# Altium project S7CAS-PLEIADES-CARTE-FILLE_P02.PrjPcb (part 2 of 2)
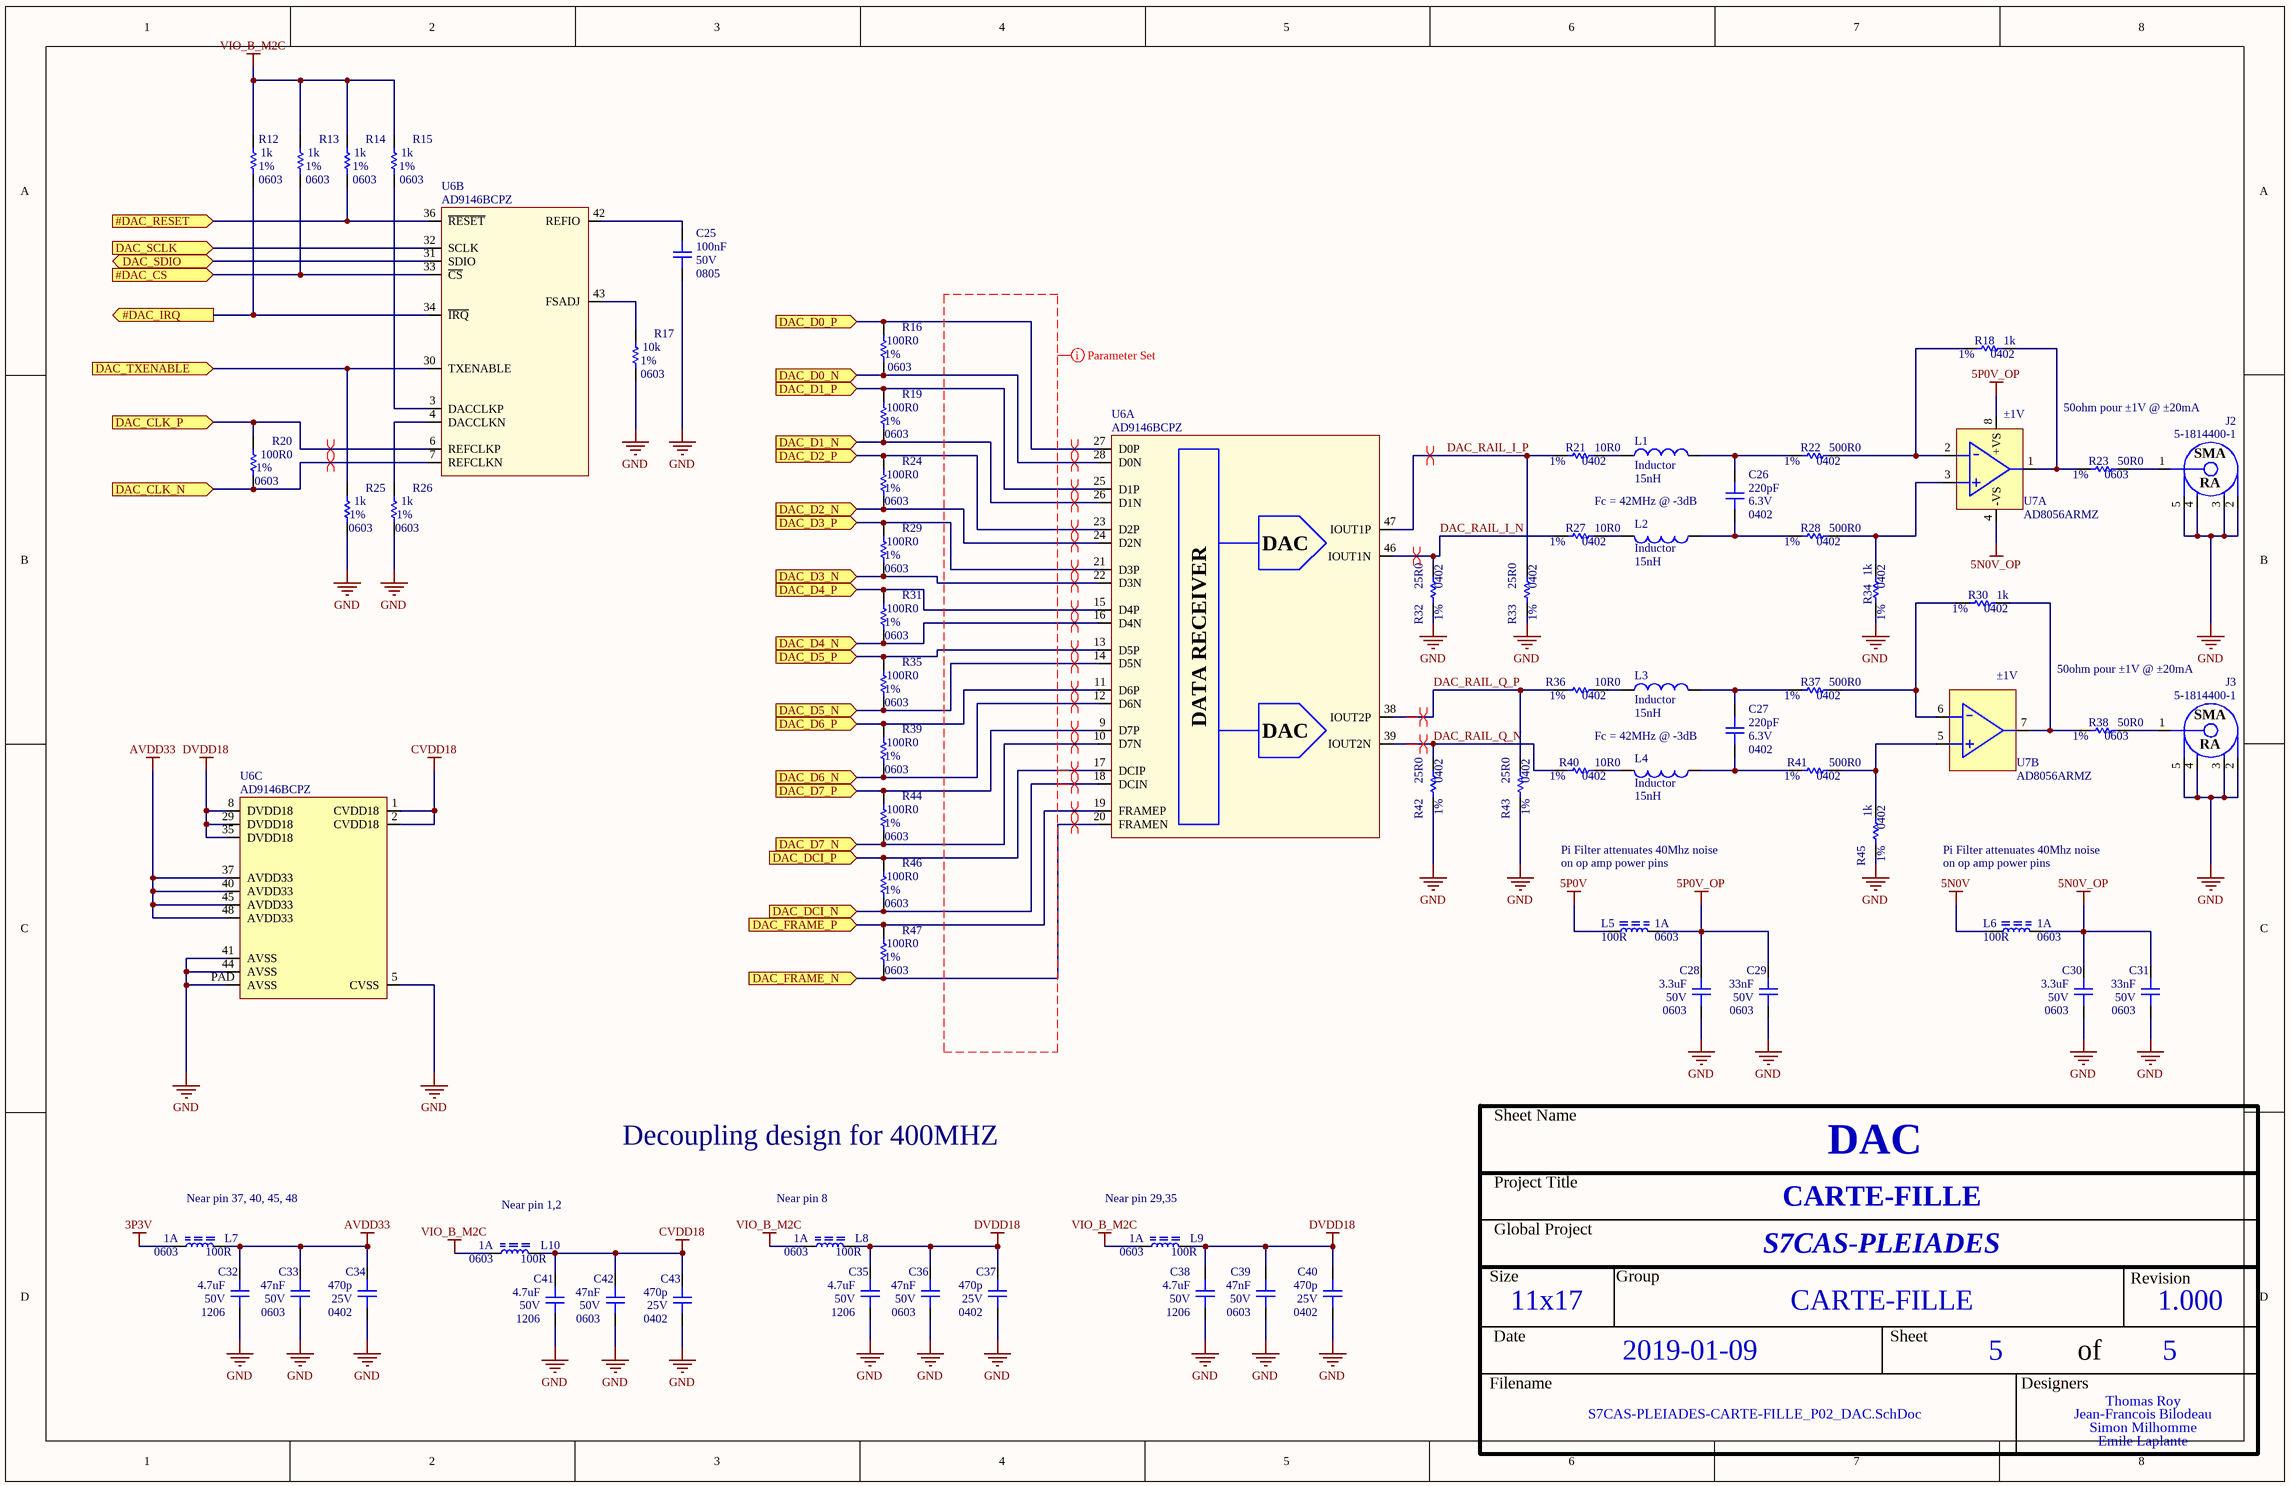
[diagram p5: S7CAS-PLEIADES-CARTE-FILLE_P02_DAC.SchDoc]

## Nets that join several sheets
3P3V: S7CAS-PLEIADES-CARTE-FILLE_P02_ALIMENTATION (C20.2 C21.2 U?.3), S7CAS-PLEIADES-CARTE-FILLE_P02_CONNECTEUR_FMC (7 pins), S7CAS-PLEIADES-CARTE-FILLE_P02_ADC (L16.1 L17.1 L50.1 L51.1), S7CAS-PLEIADES-CARTE-FILLE_P02_DAC (L7.1)
5N0V: S7CAS-PLEIADES-CARTE-FILLE_P02_ALIMENTATION (C18.2 R7.2 U4.3), S7CAS-PLEIADES-CARTE-FILLE_P02_DAC (L6.2)
5P0V: S7CAS-PLEIADES-CARTE-FILLE_P02_ALIMENTATION (C8.2 R4.2 U2.2 U2.4), S7CAS-PLEIADES-CARTE-FILLE_P02_DAC (L5.2)
12P0V: S7CAS-PLEIADES-CARTE-FILLE_P02_ALIMENTATION (7 pins), S7CAS-PLEIADES-CARTE-FILLE_P02_CONNECTEUR_FMC (J1.E35 J1.E37)
AVDD33: S7CAS-PLEIADES-CARTE-FILLE_P02_ADC (25 pins), S7CAS-PLEIADES-CARTE-FILLE_P02_DAC (8 pins)
GND: S7CAS-PLEIADES-CARTE-FILLE_P02_ALIMENTATION (26 pins), S7CAS-PLEIADES-CARTE-FILLE_P02_CONNECTEUR_FMC (162 pins), S7CAS-PLEIADES-CARTE-FILLE_P02_ADC (45 pins), S7CAS-PLEIADES-CARTE-FILLE_P02_DAC (38 pins)
VIO_B_M2C: S7CAS-PLEIADES-CARTE-FILLE_P02_ALIMENTATION (5 pins), S7CAS-PLEIADES-CARTE-FILLE_P02_CONNECTEUR_FMC (J1.J39 J1.K40), S7CAS-PLEIADES-CARTE-FILLE_P02_ADC (9 pins), S7CAS-PLEIADES-CARTE-FILLE_P02_DAC (7 pins)
#ADC_SEN: S7CAS-PLEIADES-CARTE-FILLE_P02_CONNECTEUR_FMC (J1.D25), S7CAS-PLEIADES-CARTE-FILLE_P02_ADC (U8.15)
#DAC_CS: S7CAS-PLEIADES-CARTE-FILLE_P02_CONNECTEUR_FMC (J1.J25), S7CAS-PLEIADES-CARTE-FILLE_P02_DAC (R13.1 U6.33)
#DAC_IRQ: S7CAS-PLEIADES-CARTE-FILLE_P02_CONNECTEUR_FMC (J1.D22), S7CAS-PLEIADES-CARTE-FILLE_P02_DAC (R12.1 U6.34)
#DAC_RESET: S7CAS-PLEIADES-CARTE-FILLE_P02_CONNECTEUR_FMC (J1.C21), S7CAS-PLEIADES-CARTE-FILLE_P02_DAC (R14.1 U6.36)
ADC_CLK_N: S7CAS-PLEIADES-CARTE-FILLE_P02_CONNECTEUR_FMC (J1.K5), S7CAS-PLEIADES-CARTE-FILLE_P02_ADC (C45.2 R48.1)
ADC_CLK_P: S7CAS-PLEIADES-CARTE-FILLE_P02_CONNECTEUR_FMC (J1.K4), S7CAS-PLEIADES-CARTE-FILLE_P02_ADC (C44.2 R48.2)
ADC_CLKOUT_N: S7CAS-PLEIADES-CARTE-FILLE_P02_CONNECTEUR_FMC (J1.H5), S7CAS-PLEIADES-CARTE-FILLE_P02_ADC (U8.56)
ADC_CLKOUT_P: S7CAS-PLEIADES-CARTE-FILLE_P02_CONNECTEUR_FMC (J1.H4), S7CAS-PLEIADES-CARTE-FILLE_P02_ADC (U8.57)
ADC_CTRL1: S7CAS-PLEIADES-CARTE-FILLE_P02_CONNECTEUR_FMC (J1.C24), S7CAS-PLEIADES-CARTE-FILLE_P02_ADC (U8.35)
ADC_CTRL2: S7CAS-PLEIADES-CARTE-FILLE_P02_CONNECTEUR_FMC (J1.C25), S7CAS-PLEIADES-CARTE-FILLE_P02_ADC (U8.36)
ADC_CTRL3: S7CAS-PLEIADES-CARTE-FILLE_P02_CONNECTEUR_FMC (J1.K28), S7CAS-PLEIADES-CARTE-FILLE_P02_ADC (U8.37)
ADC_DA0_N: S7CAS-PLEIADES-CARTE-FILLE_P02_CONNECTEUR_FMC (J1.H26), S7CAS-PLEIADES-CARTE-FILLE_P02_ADC (U8.40)
ADC_DA0_P: S7CAS-PLEIADES-CARTE-FILLE_P02_CONNECTEUR_FMC (J1.H25), S7CAS-PLEIADES-CARTE-FILLE_P02_ADC (U8.41)
ADC_DA2_N: S7CAS-PLEIADES-CARTE-FILLE_P02_CONNECTEUR_FMC (J1.G25), S7CAS-PLEIADES-CARTE-FILLE_P02_ADC (U8.42)
ADC_DA2_P: S7CAS-PLEIADES-CARTE-FILLE_P02_CONNECTEUR_FMC (J1.G24), S7CAS-PLEIADES-CARTE-FILLE_P02_ADC (U8.43)
ADC_DA4_N: S7CAS-PLEIADES-CARTE-FILLE_P02_CONNECTEUR_FMC (J1.H23), S7CAS-PLEIADES-CARTE-FILLE_P02_ADC (U8.44)
ADC_DA4_P: S7CAS-PLEIADES-CARTE-FILLE_P02_CONNECTEUR_FMC (J1.H22), S7CAS-PLEIADES-CARTE-FILLE_P02_ADC (U8.45)
ADC_DA6_N: S7CAS-PLEIADES-CARTE-FILLE_P02_CONNECTEUR_FMC (J1.G22), S7CAS-PLEIADES-CARTE-FILLE_P02_ADC (U8.46)
ADC_DA6_P: S7CAS-PLEIADES-CARTE-FILLE_P02_CONNECTEUR_FMC (J1.G21), S7CAS-PLEIADES-CARTE-FILLE_P02_ADC (U8.47)
ADC_DA8_N: S7CAS-PLEIADES-CARTE-FILLE_P02_CONNECTEUR_FMC (J1.E23), S7CAS-PLEIADES-CARTE-FILLE_P02_ADC (U8.50)
ADC_DA8_P: S7CAS-PLEIADES-CARTE-FILLE_P02_CONNECTEUR_FMC (J1.E22), S7CAS-PLEIADES-CARTE-FILLE_P02_ADC (U8.51)
ADC_DA10_N: S7CAS-PLEIADES-CARTE-FILLE_P02_CONNECTEUR_FMC (J1.F21), S7CAS-PLEIADES-CARTE-FILLE_P02_ADC (U8.52)
ADC_DA10_P: S7CAS-PLEIADES-CARTE-FILLE_P02_CONNECTEUR_FMC (J1.F20), S7CAS-PLEIADES-CARTE-FILLE_P02_ADC (U8.53)
ADC_DA12_N: S7CAS-PLEIADES-CARTE-FILLE_P02_CONNECTEUR_FMC (J1.G19), S7CAS-PLEIADES-CARTE-FILLE_P02_ADC (U8.54)
ADC_DA12_P: S7CAS-PLEIADES-CARTE-FILLE_P02_CONNECTEUR_FMC (J1.G18), S7CAS-PLEIADES-CARTE-FILLE_P02_ADC (U8.55)
ADC_DB0_N: S7CAS-PLEIADES-CARTE-FILLE_P02_CONNECTEUR_FMC (J1.H20), S7CAS-PLEIADES-CARTE-FILLE_P02_ADC (U8.60)
ADC_DB0_P: S7CAS-PLEIADES-CARTE-FILLE_P02_CONNECTEUR_FMC (J1.H19), S7CAS-PLEIADES-CARTE-FILLE_P02_ADC (U8.61)
ADC_DB2_N: S7CAS-PLEIADES-CARTE-FILLE_P02_CONNECTEUR_FMC (J1.E19), S7CAS-PLEIADES-CARTE-FILLE_P02_ADC (U8.62)
ADC_DB2_P: S7CAS-PLEIADES-CARTE-FILLE_P02_CONNECTEUR_FMC (J1.E18), S7CAS-PLEIADES-CARTE-FILLE_P02_ADC (U8.63)
ADC_DB4_N: S7CAS-PLEIADES-CARTE-FILLE_P02_CONNECTEUR_FMC (J1.F18), S7CAS-PLEIADES-CARTE-FILLE_P02_ADC (U8.2)
ADC_DB4_P: S7CAS-PLEIADES-CARTE-FILLE_P02_CONNECTEUR_FMC (J1.F17), S7CAS-PLEIADES-CARTE-FILLE_P02_ADC (U8.3)
ADC_DB6_N: S7CAS-PLEIADES-CARTE-FILLE_P02_CONNECTEUR_FMC (J1.H17), S7CAS-PLEIADES-CARTE-FILLE_P02_ADC (U8.4)
ADC_DB6_P: S7CAS-PLEIADES-CARTE-FILLE_P02_CONNECTEUR_FMC (J1.H16), S7CAS-PLEIADES-CARTE-FILLE_P02_ADC (U8.5)
ADC_DB8_N: S7CAS-PLEIADES-CARTE-FILLE_P02_CONNECTEUR_FMC (J1.G16), S7CAS-PLEIADES-CARTE-FILLE_P02_ADC (U8.6)
ADC_DB8_P: S7CAS-PLEIADES-CARTE-FILLE_P02_CONNECTEUR_FMC (J1.G15), S7CAS-PLEIADES-CARTE-FILLE_P02_ADC (U8.7)
ADC_DB10_N: S7CAS-PLEIADES-CARTE-FILLE_P02_CONNECTEUR_FMC (J1.E14), S7CAS-PLEIADES-CARTE-FILLE_P02_ADC (U8.8)
ADC_DB10_P: S7CAS-PLEIADES-CARTE-FILLE_P02_CONNECTEUR_FMC (J1.E15), S7CAS-PLEIADES-CARTE-FILLE_P02_ADC (U8.9)
ADC_DB12_N: S7CAS-PLEIADES-CARTE-FILLE_P02_CONNECTEUR_FMC (J1.F15), S7CAS-PLEIADES-CARTE-FILLE_P02_ADC (U8.10)
ADC_DB12_P: S7CAS-PLEIADES-CARTE-FILLE_P02_CONNECTEUR_FMC (J1.F14), S7CAS-PLEIADES-CARTE-FILLE_P02_ADC (U8.11)
ADC_RESET: S7CAS-PLEIADES-CARTE-FILLE_P02_CONNECTEUR_FMC (J1.C22), S7CAS-PLEIADES-CARTE-FILLE_P02_ADC (R53.2 U8.12)
ADC_SCLK: S7CAS-PLEIADES-CARTE-FILLE_P02_CONNECTEUR_FMC (J1.K26), S7CAS-PLEIADES-CARTE-FILLE_P02_ADC (U8.13)
ADC_SDATA: S7CAS-PLEIADES-CARTE-FILLE_P02_CONNECTEUR_FMC (J1.D26), S7CAS-PLEIADES-CARTE-FILLE_P02_ADC (U8.14)
DAC_CLK_N: S7CAS-PLEIADES-CARTE-FILLE_P02_CONNECTEUR_FMC (J1.J2), S7CAS-PLEIADES-CARTE-FILLE_P02_DAC (R20.1 U6.7)
DAC_CLK_P: S7CAS-PLEIADES-CARTE-FILLE_P02_CONNECTEUR_FMC (J1.J3), S7CAS-PLEIADES-CARTE-FILLE_P02_DAC (R20.2 U6.6)
DAC_D0_N: S7CAS-PLEIADES-CARTE-FILLE_P02_CONNECTEUR_FMC (J1.G7), S7CAS-PLEIADES-CARTE-FILLE_P02_DAC (R16.1 U6.28)
DAC_D0_P: S7CAS-PLEIADES-CARTE-FILLE_P02_CONNECTEUR_FMC (J1.G6), S7CAS-PLEIADES-CARTE-FILLE_P02_DAC (R16.2 U6.27)
DAC_D1_N: S7CAS-PLEIADES-CARTE-FILLE_P02_CONNECTEUR_FMC (J1.F9), S7CAS-PLEIADES-CARTE-FILLE_P02_DAC (R19.1 U6.26)
DAC_D1_P: S7CAS-PLEIADES-CARTE-FILLE_P02_CONNECTEUR_FMC (J1.F8), S7CAS-PLEIADES-CARTE-FILLE_P02_DAC (R19.2 U6.25)
DAC_D2_N: S7CAS-PLEIADES-CARTE-FILLE_P02_CONNECTEUR_FMC (J1.H8), S7CAS-PLEIADES-CARTE-FILLE_P02_DAC (R24.1 U6.24)
DAC_D2_P: S7CAS-PLEIADES-CARTE-FILLE_P02_CONNECTEUR_FMC (J1.H7), S7CAS-PLEIADES-CARTE-FILLE_P02_DAC (R24.2 U6.23)
DAC_D3_N: S7CAS-PLEIADES-CARTE-FILLE_P02_CONNECTEUR_FMC (J1.G10), S7CAS-PLEIADES-CARTE-FILLE_P02_DAC (R29.1 U6.22)
DAC_D3_P: S7CAS-PLEIADES-CARTE-FILLE_P02_CONNECTEUR_FMC (J1.G9), S7CAS-PLEIADES-CARTE-FILLE_P02_DAC (R29.2 U6.21)
DAC_D4_N: S7CAS-PLEIADES-CARTE-FILLE_P02_CONNECTEUR_FMC (J1.H11), S7CAS-PLEIADES-CARTE-FILLE_P02_DAC (R31.1 U6.16)
DAC_D4_P: S7CAS-PLEIADES-CARTE-FILLE_P02_CONNECTEUR_FMC (J1.H10), S7CAS-PLEIADES-CARTE-FILLE_P02_DAC (R31.2 U6.15)
DAC_D5_N: S7CAS-PLEIADES-CARTE-FILLE_P02_CONNECTEUR_FMC (J1.F12), S7CAS-PLEIADES-CARTE-FILLE_P02_DAC (R35.1 U6.14)
DAC_D5_P: S7CAS-PLEIADES-CARTE-FILLE_P02_CONNECTEUR_FMC (J1.F11), S7CAS-PLEIADES-CARTE-FILLE_P02_DAC (R35.2 U6.13)
DAC_D6_N: S7CAS-PLEIADES-CARTE-FILLE_P02_CONNECTEUR_FMC (J1.E11), S7CAS-PLEIADES-CARTE-FILLE_P02_DAC (R39.1 U6.12)
DAC_D6_P: S7CAS-PLEIADES-CARTE-FILLE_P02_CONNECTEUR_FMC (J1.E10), S7CAS-PLEIADES-CARTE-FILLE_P02_DAC (R39.2 U6.11)
DAC_D7_N: S7CAS-PLEIADES-CARTE-FILLE_P02_CONNECTEUR_FMC (J1.H14), S7CAS-PLEIADES-CARTE-FILLE_P02_DAC (R44.1 U6.10)
DAC_D7_P: S7CAS-PLEIADES-CARTE-FILLE_P02_CONNECTEUR_FMC (J1.H13), S7CAS-PLEIADES-CARTE-FILLE_P02_DAC (R44.2 U6.9)
DAC_DCI_N: S7CAS-PLEIADES-CARTE-FILLE_P02_CONNECTEUR_FMC (J1.G3), S7CAS-PLEIADES-CARTE-FILLE_P02_DAC (R46.1 U6.18)
DAC_DCI_P: S7CAS-PLEIADES-CARTE-FILLE_P02_CONNECTEUR_FMC (J1.G2), S7CAS-PLEIADES-CARTE-FILLE_P02_DAC (R46.2 U6.17)
DAC_FRAME_N: S7CAS-PLEIADES-CARTE-FILLE_P02_CONNECTEUR_FMC (J1.G13), S7CAS-PLEIADES-CARTE-FILLE_P02_DAC (R47.1 U6.20)
DAC_FRAME_P: S7CAS-PLEIADES-CARTE-FILLE_P02_CONNECTEUR_FMC (J1.G12), S7CAS-PLEIADES-CARTE-FILLE_P02_DAC (R47.2 U6.19)
DAC_SCLK: S7CAS-PLEIADES-CARTE-FILLE_P02_CONNECTEUR_FMC (J1.K25), S7CAS-PLEIADES-CARTE-FILLE_P02_DAC (U6.32)
DAC_SDIO: S7CAS-PLEIADES-CARTE-FILLE_P02_CONNECTEUR_FMC (J1.J24), S7CAS-PLEIADES-CARTE-FILLE_P02_DAC (U6.31)
DAC_TXENABLE: S7CAS-PLEIADES-CARTE-FILLE_P02_CONNECTEUR_FMC (J1.D23), S7CAS-PLEIADES-CARTE-FILLE_P02_DAC (R25.2 U6.30)